# EAGLE design serbest (EAGLE 9.6.2)
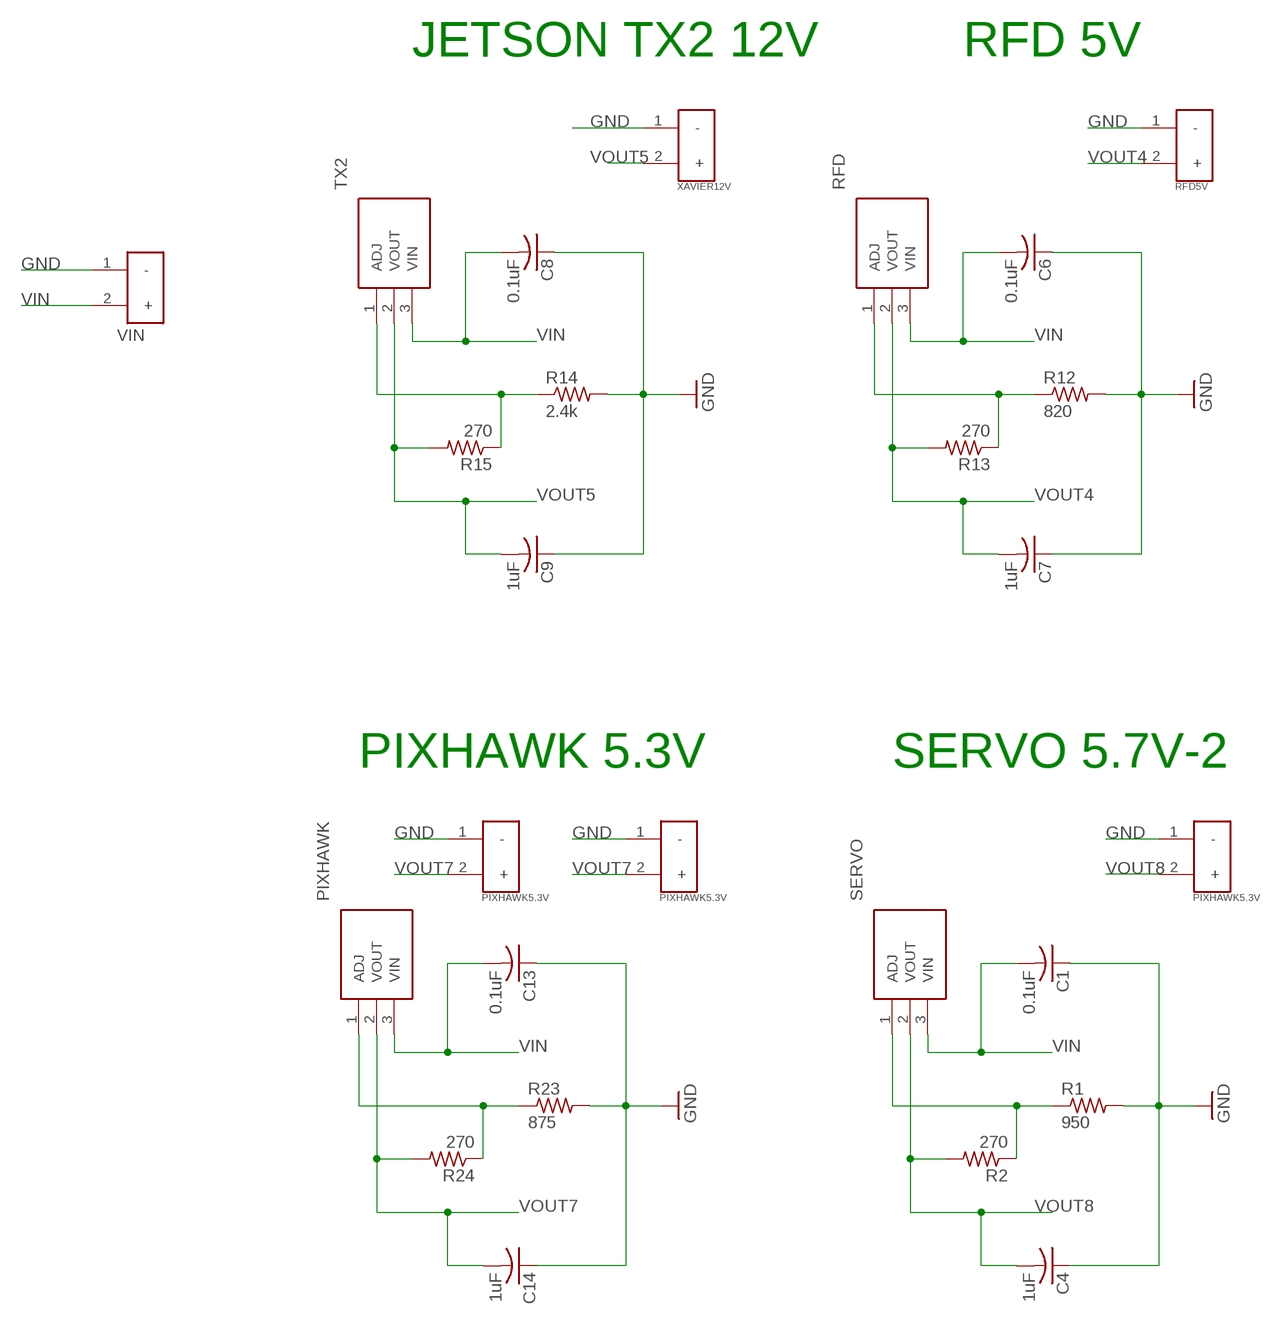
[diagram p0: schematic, sheet 1]

## Parts
C1  0.1uF  C-USC0402K  [C0402K]
C4  1uF  C-USC0402K  [C0402K]
C6  0.1uF  C-USC0402K  [C0402K]
C7  1uF  C-USC0402K  [C0402K]
C8  0.1uF  C-USC0402K  [C0402K]
C9  1uF  C-USC0402K  [C0402K]
C13  0.1uF  C-USC0402K  [C0402K]
C14  1uF  C-USC0402K  [C0402K]
J3  VIN  XT60-M  [AMASS_XT60-M]
PIXHAWK  PIXHAWK  LM338T_NOPB  [TO254P470X1028X1955-3P]
PIXHAWK5.3V-1  PIXHAWK5.3V  XT60-M  [AMASS_XT60-M]
PIXHAWK5.3V-2  PIXHAWK5.3V  XT60-M  [AMASS_XT60-M]
R1  950  R-US_R0805  [R0805]
R2  270  R-US_R0805  [R0805]
R12  820  R-US_R0805  [R0805]
R13  270  R-US_R0805  [R0805]
R14  2.4k  R-US_R0805  [R0805]
R15  270  R-US_R0805  [R0805]
R23  875  R-US_R0805  [R0805]
R24  270  R-US_R0805  [R0805]
RFD  RFD  LM338T_NOPB  [TO254P470X1028X1955-3P]
RFD5V  RFD5V  XT60-M  [AMASS_XT60-M]
SERVO5.7V-2  PIXHAWK5.3V  XT60-M  [AMASS_XT60-M]
SERVO-2  SERVO  LM338T_NOPB  [TO254P470X1028X1955-3P]
TX2  TX2  LM338T_NOPB  [TO254P470X1028X1955-3P]
TX2-12V  XAVIER12V  XT60-M  [AMASS_XT60-M]

## Nets
GND [asda]: C1.1 C4.1 C6.1 C7.1 C8.1 C9.1 C13.1 C14.1 J3.1(-) PIXHAWK5.3V-1.1(-) PIXHAWK5.3V-2.1(-) R1.2 R12.2 R14.2 R23.2 RFD5V.1(-) SERVO5.7V-2.1(-) TX2-12V.1(-)
N$1: R1.1 R2.1 SERVO-2.1(ADJ)
N$11: R12.1 R13.1 RFD.1(ADJ)
N$13: R14.1 R15.1 TX2.1(ADJ)
N$17: PIXHAWK.1(ADJ) R23.1 R24.1
VIN [asda]: C1.2 C6.2 C8.2 C13.2 J3.2(+) PIXHAWK.3(VIN) RFD.3(VIN) SERVO-2.3(VIN) TX2.3(VIN)
VOUT4: C7.2 R13.2 RFD5V.2(+) RFD.2(VOUT)
VOUT5: C9.2 R15.2 TX2-12V.2(+) TX2.2(VOUT)
VOUT7: C14.2 PIXHAWK5.3V-1.2(+) PIXHAWK5.3V-2.2(+) PIXHAWK.2(VOUT) R24.2
VOUT8: C4.2 R2.2 SERVO5.7V-2.2(+) SERVO-2.2(VOUT)

## Notes on the sheet
- JETSON TX2 12V | RFD 5V
- PIXHAWK 5.3V | SERVO 5.7V-2

## Library data of the parts
C1 C4 C6-C9 C13 C14 = adafruit:C-US: CAPACITOR, American symbol
J3 PIXHAWK5.3V-1 PIXHAWK5.3V-2 RFD5V SERVO5.7V-2 TX2-12V = XT60-M:XT60-M: DC supply; XT60; male; PIN:2; for cable; soldered; 60A; 500V; AVAILABILITY: Unavailable; DESCRIPTION: Plug; DC supply; XT60; male; PIN: 2; for cable; soldered; 30A; 500V; MF: AMASS; MP: XT60-M; PACKAGE: Package; PRICE: None
PIXHAWK RFD SERVO-2 TX2 = LM338T_NOPB:LM338T_NOPB: 5 Amp Adjustable Regulator LM338T LM338T/NOPB, Voltage Regulator, 5A Adjustable 1.2 32 V, 25W, 3-Pin TO-220 Source: Datasheet <http://www.ti.com/lit/ds/symlink/lm338.pdf>; ARROW_PART_NUMBER: LM338T/NOPB; ARROW_PRICE-STOCK: https://www.arrow.com/en/products/lm338tnopb/texas-instruments; DESCRIPTION: 5 Amp Adjustable Regulator LM338T LM338T/NOPB, Voltage Regulator, 5A Adjustable 1.2 32 V, 25W, 3-Pin TO-220; HEIGHT: 4.7mm; MANUFACTURER_NAME: Texas Instruments; MANUFACTURER_PART_NUMBER: LM338T/NOPB; MOUSER_PART_NUMBER: 926-LM338T/NOPB; MOUSER_PRICE-STOCK: https://www.mouser.co.uk/ProductDetail/Texas-Instruments/LM338T-NOPB?qs=X1J7HmVL2ZENaH7%2FMvkSlw%3D%3D
R1 R2 R12-R15 R23 R24 = adafruit:R-US_: RESISTOR, American symbol

## Net classes
1 asda: width 0.7 mm

## Board
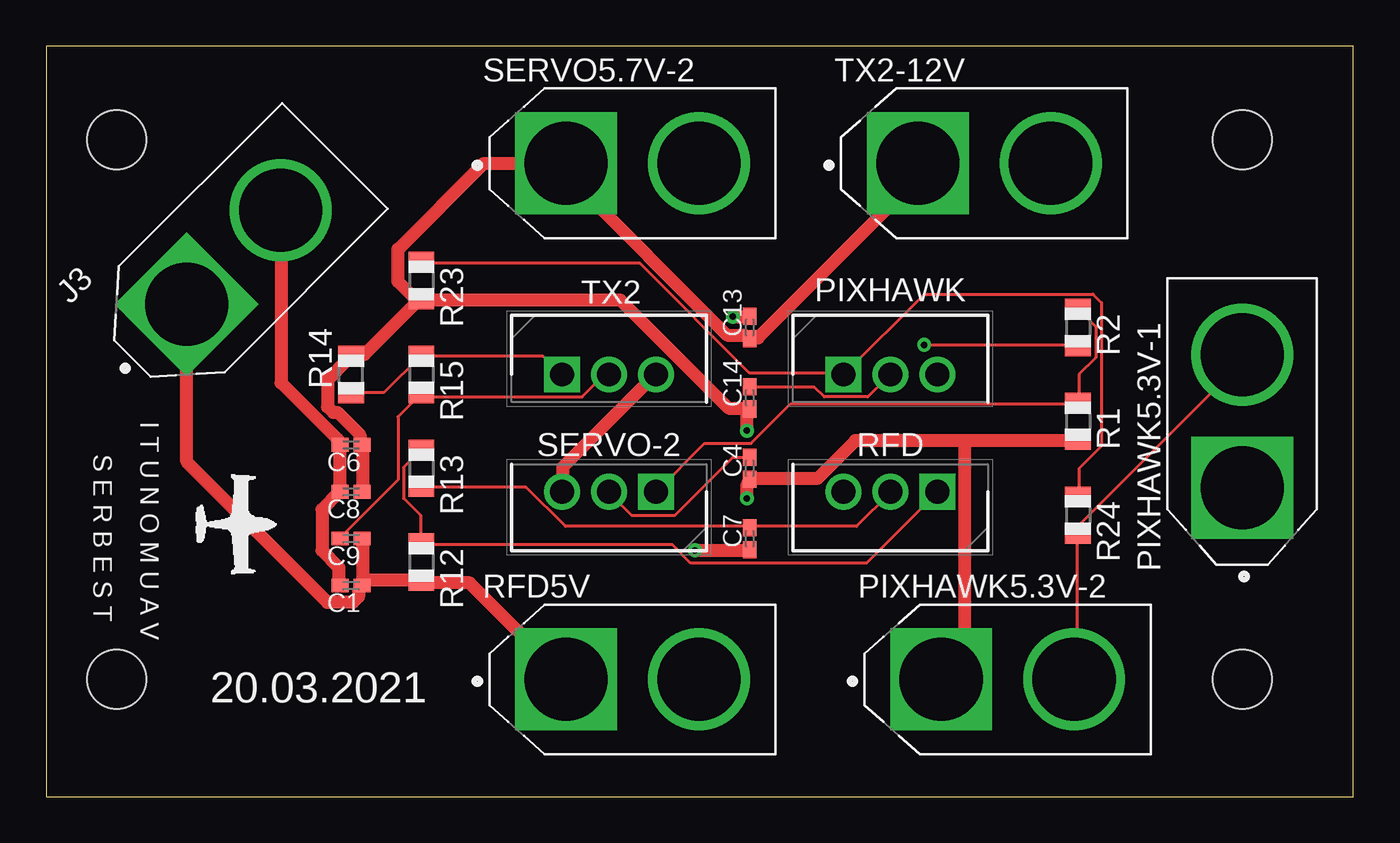
[diagram p1: board, top side]
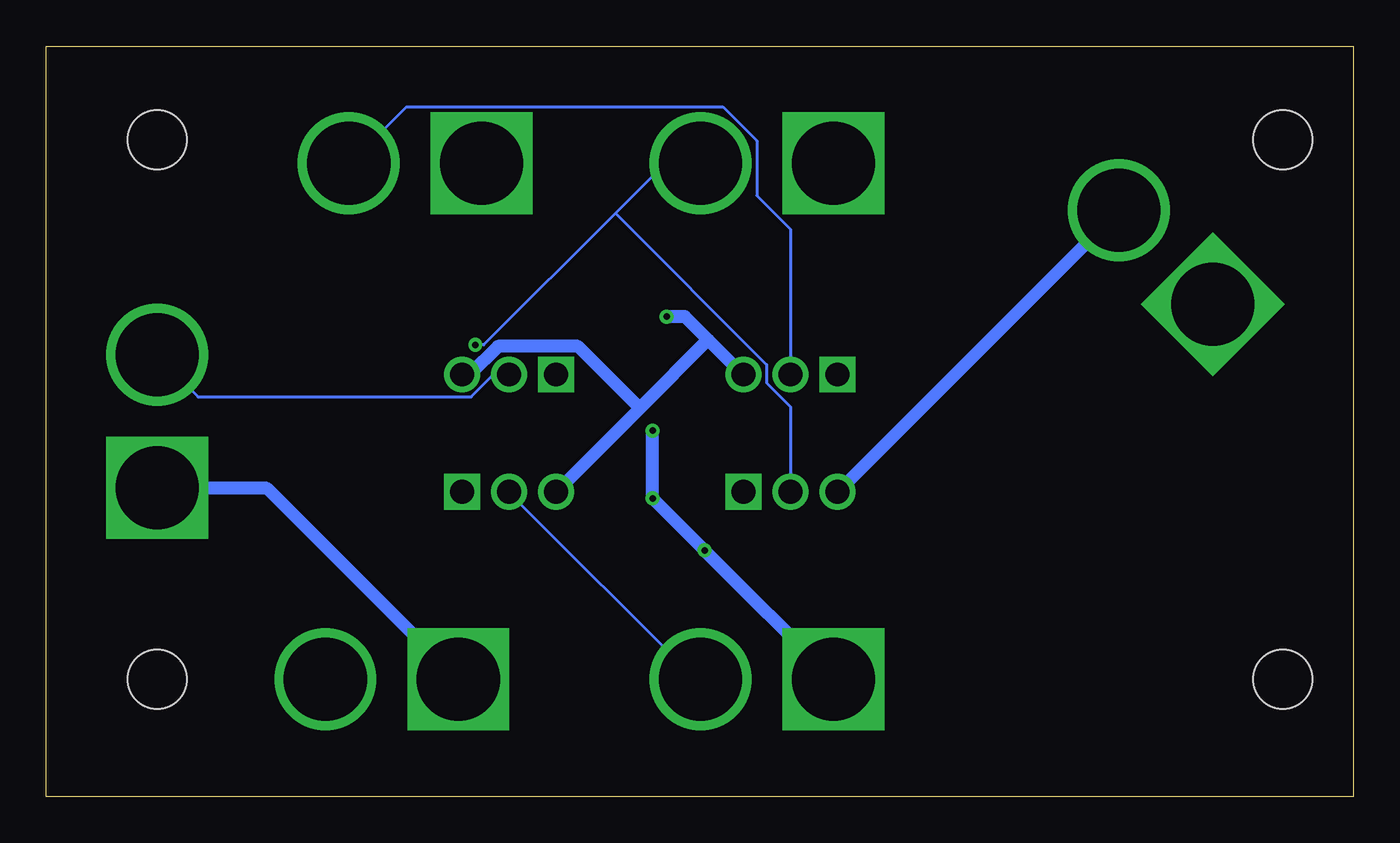
[diagram p2: board, bottom side, seen from below]

Size 70.79 x 40.63 mm. Coordinates in mm from the lower left corner, seen from the top.
Outline: 0,0 70.79,0 70.79,40.63 0,40.63 0,0
Copper layers (1*16): Top 0.035mm / dielectric 1.5mm / Bottom 0.035mm
Design rules "default": minimum track width 6mil, minimum drill 0.35mm, track to track 6mil, track to pad 6mil, pad to pad 6mil, via to via 6mil, smd to smd 6mil, copper to edge 40mil, drill to drill 6mil, minimum pad ring 10mil, minimum via ring 8mil, stop-mask expansion 4mil, vias tented up to drill 0mil, thermal gap 10mil
Holes 3.2 mm at 3.81,35.56 64.77,35.56 64.77,6.35 3.81,6.35

### Footprints (pad centres in the part's own frame; a part is rotated, then mirrored left to right if it is on the bottom)
C0402K = smd 0.925 x 0.74: 1 -0.6,0; 2 0.6,0
AMASS_XT60-M = drill 4.5 square: 1 -3.6,0 | drill 4.5: 2 3.6,0
TO254P470X1028X1955-3P = drill 1.29 pad 1.935 square: 1 0,0 | drill 1.29 pad 1.935: 2 2.54,0; 3 5.08,0
R0805 = smd 1.1 x 1.4: 1 -1,0; 2 1,0

### Placement (x,y rotation side)
C1  16.51,11.43 180 top
C4  38.1,17.78 90 top
C6  16.51,19.05 180 top
C7  38.1,13.97 90 top
C8  16.51,16.51 180 top
C9  16.51,13.97 180 top
C13  38.1,25.4 90 top
C14  38.1,21.59 90 top
J3  10.16,29.21 45 top
PIXHAWK  43.18,22.86 0 top
PIXHAWK5.3V-1  64.77,20.32 90 top
PIXHAWK5.3V-2  52.07,6.35 0 top
R1  55.88,20.32 270 top
R2  55.88,25.4 270 top
R12  20.32,12.7 270 top
R13  20.32,17.78 270 top
R14  16.51,22.86 90 top
R15  20.32,22.86 270 top
R23  20.32,27.94 270 top
R24  55.88,15.24 270 top
RFD  48.26,16.51 180 top
RFD5V  31.75,6.35 0 top
SERVO5.7V-2  31.75,34.29 0 top
SERVO-2  33.02,16.51 180 top
TX2  27.94,22.86 0 top
TX2-12V  50.8,34.29 0 top

### Tracks (layer width: path | path; a pad name or v marks a point on that pad's centre or on a via)
GND  (via drill 0.35)
  Top 0.7: TX2-12V.1 47.17,34.29 47.17,33.45 38.56,24.84 38.1,24.84 C13.1 37.8,24.99 36.88,24.99 28.27,33.6 28.27,33.98 SERVO5.7V-2.1 23.7,34.29 19.05,29.64 19.05,27.89 19.89,27.05 R23.2 | C8.1 17.14,16.54 17.14,19.05 C6.1 16.99,19.36 16.99,19.58 15.77,20.8 15.54,20.8 15.24,21.11 15.24,22.55 16.31,23.62 R14.2 16.54,23.93 17.22,23.93 20.04,26.75 R23.2 | R23.2 20.34,26.9 31.09,26.9 36.96,21.03 38.1,21.03 C14.1 37.95,20.65 v37.95,19.81 | 49.76,19.28 55.85,19.28 R1.2 | 49.76,19.28 43.81,19.28 41.76,17.22 38.1,17.22 C4.1 37.95,16.84 v37.95,16.15 | 49.76,19.28 49.76,7.62 48.54,6.4 PIXHAWK5.3V-2.1 | C1.1 17.14,11.43 17.14,13.95 C9.1 | C1.1 17.45,11.73 20.27,11.73 R12.2 20.65,11.58 22.94,11.58 28.12,6.4 RFD5V.1 | v35.13,13.34 38.1,13.34 C7.1 | J3.1 7.62,26.59 7.62,18.14 15.24,10.52 16.61,10.52 16.92,10.82 16.92,11.12 C1.1
  Bottom 0.7: PIXHAWK5.3V-1.1 64.77,16.69 58.83,16.69 48.54,6.4 PIXHAWK5.3V-2.1 | RFD5V.1 28.19,6.4 v35.13,13.34 v37.95,16.15 v37.95,19.81
N$1
  Top 0.152: R2.1 55.93,26.36 56.84,25.45 56.84,23.77 55.93,22.86 55.93,21.34 R1.1 55.85,21.26 40.31,21.26 38.18,19.13 35.66,19.13 33.07,16.54 SERVO-2.1
N$11
  Top 0.152: R13.1 20.27,18.75 19.36,17.83 19.36,16.15 20.27,15.24 20.27,13.72 R12.1 20.34,13.64 33.91,13.64 34.9,12.65 44.42,12.65 48.23,16.46 RFD.1
N$13
  Top 0.152: R14.1 16.54,21.87 18.29,21.87 20.27,23.85 R15.1 20.34,23.85 26.9,23.85 27.89,22.86 TX2.1
N$17
  Top 0.152: R23.1 20.34,28.88 32.16,28.88 38.1,22.94 43.05,22.94 43.13,22.86 PIXHAWK.1 43.2,22.86 47.55,27.2 56.69,27.2 57.15,26.75 57.15,18.97 55.93,17.75 55.93,16.31 R24.1
VIN  (via drill 0.35)
  Top 0.7: v37.19,25.98 38.1,25.98 C13.2 | SERVO-2.3 27.96,16.54 27.96,17.83 32.99,22.86 TX2.3 | C1.2 15.85,11.43 15.85,12.42 14.94,13.34 14.94,15.54 15.85,16.46 C8.2 15.93,16.84 15.93,19.05 C6.2 15.77,19.36 12.72,22.4 12.72,31.7 J3.2
  Bottom 0.7: v37.19,25.98 36.2,25.98 34.94,24.73 | 34.94,24.73 33.07,22.86 TX2.3 | 34.94,24.73 38.63,21.03 | 38.63,21.03 43.13,16.54 RFD.3 | PIXHAWK.3 47.85,22.86 46.33,24.38 41.99,24.38 38.63,21.03 | SERVO-2.3 27.89,16.54 12.72,31.7 J3.2
VOUT4
  Top 0.152: 38.1,14.63 43.89,14.63 45.72,16.46 RFD.2 | 38.1,14.63 28.12,14.63 25.98,16.76 20.34,16.76 R13.2 | 38.1,14.63 C7.2
  Bottom 0.152: RFD5V.2 35.36,6.4 35.66,6.4 45.72,16.46 RFD.2
VOUT5
  Top 0.152: C9.2 15.93,14.02 19.05,17.14 19.05,20.57 20.27,21.79 R15.2 20.34,21.79 20.5,21.64 29.03,21.64 30.25,22.86 TX2.2
  Bottom 0.152: TX2.2 30.48,30.71 32.31,32.54 32.31,35.51 34.14,37.34 51.28,37.34 54.33,34.29 TX2-12V.2
VOUT7
  Top 0.152: PIXHAWK5.3V-2.2 55.7,6.4 55.85,6.55 55.85,14.17 R24.2 55.93,14.25 55.93,14.71 64.77,23.55 PIXHAWK5.3V-1.2 | PIXHAWK.2 44.5,21.64 42.14,21.64 41.6,22.17 38.1,22.17 C14.2
  Bottom 0.152: PIXHAWK.2 46.56,22.86 47.78,21.64 62.56,21.64 64.77,23.85 PIXHAWK5.3V-1.2
VOUT8  (via drill 0.35)
  Top 0.152: C4.2 38.1,18.36 37.19,18.36 34.06,15.24 31.7,15.24 30.48,16.46 SERVO-2.2 | v47.55,24.46 55.85,24.46 R2.2
  Bottom 0.152: v47.55,24.46 47.09,24.46 39.97,31.59 | 39.97,31.59 37.26,34.29 SERVO5.7V-2.2 | SERVO-2.2 30.48,21.11 31.77,22.4 31.77,23.39 39.97,31.59

### Text on the board
tNames: I T U N O M U A V | S E R B E S T | 20.03.2021